# EAGLE board AniBike_v2.7_BT_MainBoard (EAGLE 5.08)
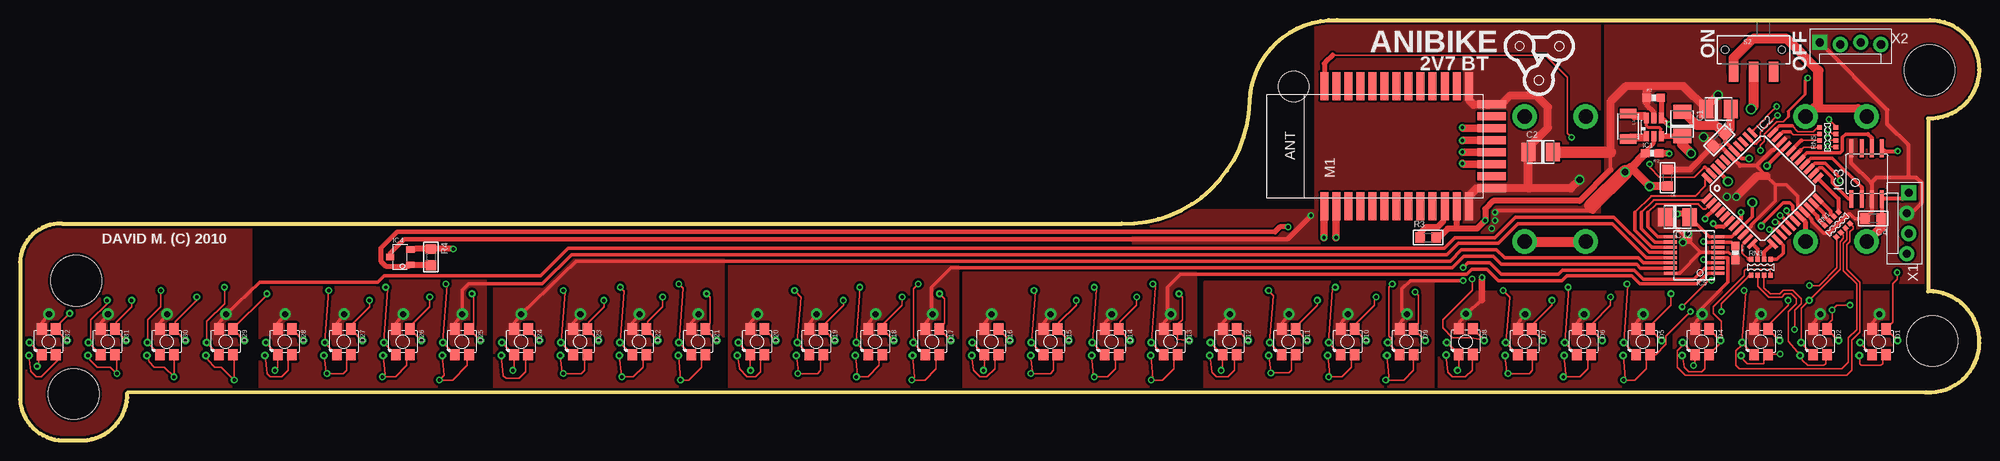
[diagram p5: board, top side]
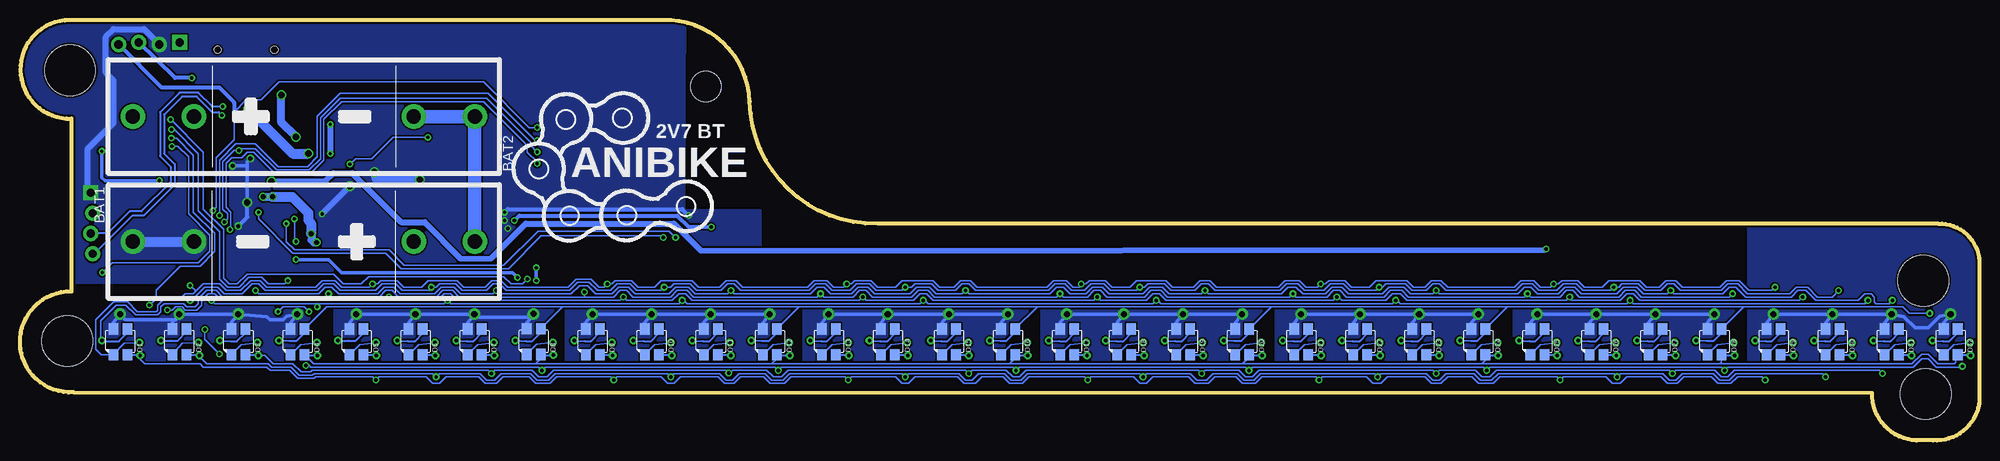
[diagram p6: board, bottom side, seen from below]

Size 244.44 x 52.44 mm. Coordinates in mm from the lower left corner, seen from the top.
Outline: 137.47,27.03 arc90 153.42,42.27 arc-90 164.29,52.43 238.25,52.43 arc-182 238.05,40.14 238.05,18.6 arc-184 237.74,6 13.39,5.94 arc-90 7.82,0.01 5.79,0.01 arc-90 0,5.09 0,22.26 arc-90 5.18,27.03 137.47,27.03
Copper layers (1*16): Top 0.035mm / dielectric 1.5mm / Bottom 0.035mm
Design rules "default *": minimum track width 8mil, minimum drill 15mil, track to track 8mil, track to pad 8mil, pad to pad 8mil, via to via 8mil, smd to smd 8mil, copper to edge 10mil, drill to drill 15mil, minimum pad ring 10mil, minimum via ring 8mil, stop-mask expansion 4mil, vias tented up to drill 32mil, thermal gap 10mil
Holes 6.35 mm at 238.56,12.4 238.2,46.19 7.01,19.92 6.71,5.8
Holes 3.81 mm at 158.88,44.13

## Footprints (pad centres in the part's own frame; a part is rotated, then mirrored left to right if it is on the bottom)
BATTERY_AAA = drill 1.778 pad 3.048 round: MINUS1 21.336,0; MINUS2 13.716,0; PLUS1 -21.336,0; PLUS2 -13.716,0
C3528-21/T = smd 1.778 x 2.286: + 1.524,0; - -1.524,0
C0805 = smd 1.2 x 1.3: 1 -1.016,0; 2 1.016,0
LED1210_DS = drill 0.432 pad 0.889 round: 1 -2.421,-0.099; 2 -2.504,-1.68; 3 2.27,0.15 | smd 1.2 x 1.4 bottom: 1_BOTTOM 0.85,-1.6; 2_BOTTOM -0.9,-1.6; 3_BOTTOM -0.9,1.6; 4_BOTTOM 0.85,1.6 | smd 1.2 x 1.4: 1_TOP -0.9,-1.6; 2_TOP 0.85,-1.6; 3_TOP 0.85,1.6; 4_TOP -0.9,1.6 | drill 0.762 pad 1.422 round: 4 0,3.454
DDC = smd 0.635 x 1.27: 1 -0.95,-1.15; 2 0,-1.15; 3 0.95,-1.15; 4 0.95,1.15; 5 0,1.15; 6 -0.95,1.15
TQFP44 = smd 1.5 x 0.5: 1 -5.8,4; 2 -5.8,3.2; 3 -5.8,2.4; 4 -5.8,1.6; 5 -5.8,0.8; 6 -5.8,0; 7 -5.8,-0.8; 8 -5.8,-1.6; 9 -5.8,-2.4; 10 -5.8,-3.2; 11 -5.8,-4; 23 5.8,-4; 24 5.8,-3.2; 25 5.8,-2.4; 26 5.8,-1.6; 27 5.8,-0.8; 28 5.8,0; 29 5.8,0.8; 30 5.8,1.6; 31 5.8,2.4; 32 5.8,3.2; 33 5.8,4 | smd 0.5 x 1.5: 12 -4,-5.8; 13 -3.2,-5.8; 14 -2.4,-5.8; 15 -1.6,-5.8; 16 -0.8,-5.8; 17 0,-5.8; 18 0.8,-5.8; 19 1.6,-5.8; 20 2.4,-5.8; 21 3.2,-5.8; 22 4,-5.8; 34 4,5.8; 35 3.2,5.8; 36 2.4,5.8; 37 1.6,5.8; 38 0.8,5.8; 39 0,5.8; 40 -0.8,5.8; 41 -1.6,5.8; 42 -2.4,5.8; 43 -3.2,5.8; 44 -4,5.8
SOIC8 = smd 0.5 x 2.2: 1 -1.905,-3.154; 2 -0.645,-3.154; 3 0.625,-3.154; 4 1.895,-3.154; 5 1.905,3.154; 6 0.635,3.154; 7 -0.635,3.154; 8 -1.905,3.154
HALL_SENSOR_SE = smd 1 x 0.8: 1 1.15,-1; 2 1.15,0.9; 3 -1.35,-0.05
TSSOP16 = smd 0.4 x 1.6: 1 -2.225,-2.85; 2 -1.575,-2.85; 3 -0.925,-2.85; 4 -0.275,-2.85; 5 0.375,-2.85; 6 1.025,-2.85; 7 1.675,-2.85; 8 2.325,-2.85; 9 2.325,3.05; 10 1.675,3.05; 11 1.025,3.05; 12 0.375,3.05; 13 -0.275,3.05; 14 -0.925,3.05; 15 -1.575,3.05; 16 -2.225,3.05
1210 = smd 1.2 x 2: 1 -1.6,0; 2 1.6,0
BTM400_6B = smd 3.5 x 1: 1 -7.4,7.66; 2 -7.4,6.16; 3 -7.4,4.66; 4 -7.4,3.16; 5 -7.4,1.66; 6 -7.4,0.16; 7 -7.4,-1.34; 8 -7.4,-2.84; 9 -7.4,-4.34; 10 -7.4,-5.84; 11 -7.4,-7.34; 12 -7.4,-8.84; 13 -7.4,-10.34; 22 7.6,-10.34; 23 7.6,-8.84; 24 7.6,-7.34; 25 7.6,-5.84; 26 7.6,-4.34; 27 7.6,-2.84; 28 7.6,-1.34; 29 7.6,0.16; 30 7.6,1.66; 31 7.6,3.16; 32 7.6,4.66; 33 7.6,6.16; 34 7.6,7.66 | smd 1 x 3.5: 14 -5.15,-13.2; 15 -3.65,-13.2; 16 -2.15,-13.2; 17 -0.65,-13.2; 18 0.85,-13.2; 19 2.35,-13.2; 20 3.85,-13.2; 21 5.35,-13.2
0603-RES = smd 1.1 x 1: 1 -0.85,0; 2 0.85,0
R0805 = smd 1.2 x 1.3: 1 -1.016,0; 2 1.016,0
YCTC164 = smd 0.559 x 0.6: P$1 -1.2,-1.003; P$2 -0.4,-1.003; P$3 0.4,-1.003; P$4 1.2,-1.003; P$5 1.2,1.003; P$6 0.4,1.003; P$7 -0.4,1.003; P$8 -1.2,1.003
SWITCH-SPDT-SMD = smd 1.2 x 2.5: 1 -2.5,-2.75; 2 0,-2.75; 3 2.5,-2.75 | hole 0.9: -3.55,0; 3.55,0
MOLEX-1X4_LOCK = drill 1.016 pad 1.88 square: 1 0,0.127 | drill 1.016 pad 1.88 round: 2 2.54,-0.127; 3 5.08,0.127; 4 7.62,-0.127

## Placement (x,y rotation side)
BAT1  BATTERY_AAA  [BATTERY_AAA]  209.04,24.8 180 bottom
BAT2  BATTERY_AAA  [BATTERY_AAA]  209.04,40.4 0 bottom
C1  10uF  [C3528-21/T]  207.37,39.48 270 top
C2  10uF  [C3528-21/T]  189.69,35.98 0 top
C3  100nF  [C0805]  211.99,37.45 225 top
C4  100nF  [C0805]  231.17,27.67 180 top
C6  100nF  [C0805]  205.54,32.78 90 top
C11  47uF  [C3528-21/T]  211.89,41.36 180 top
C12  10uF  [C3528-21/T]  206.76,27.85 180 top
D1  LED_RGB_DS  [LED1210_DS]  231.95,12.3 0 top
D2  LED_RGB_DS  [LED1210_DS]  224.59,12.3 0 top
D3  LED_RGB_DS  [LED1210_DS]  217.22,12.3 0 top
D4  LED_RGB_DS  [LED1210_DS]  209.85,12.3 0 top
D5  LED_RGB_DS  [LED1210_DS]  202.49,12.3 0 top
D6  LED_RGB_DS  [LED1210_DS]  195.12,12.3 0 top
D7  LED_RGB_DS  [LED1210_DS]  187.76,12.3 0 top
D8  LED_RGB_DS  [LED1210_DS]  180.39,12.33 0 top
D9  LED_RGB_DS  [LED1210_DS]  173.02,12.3 0 top
D10  LED_RGB_DS  [LED1210_DS]  165.66,12.3 0 top
D11  LED_RGB_DS  [LED1210_DS]  158.29,12.3 0 top
D12  LED_RGB_DS  [LED1210_DS]  150.93,12.3 0 top
D13  LED_RGB_DS  [LED1210_DS]  143.56,12.3 0 top
D14  LED_RGB_DS  [LED1210_DS]  136.19,12.3 0 top
D15  LED_RGB_DS  [LED1210_DS]  128.57,12.3 0 top
D16  LED_RGB_DS  [LED1210_DS]  121.21,12.3 0 top
D17  LED_RGB_DS  [LED1210_DS]  113.84,12.3 0 top
D18  LED_RGB_DS  [LED1210_DS]  106.73,12.3 0 top
D19  LED_RGB_DS  [LED1210_DS]  99.36,12.3 0 top
D20  LED_RGB_DS  [LED1210_DS]  92,12.3 0 top
D21  LED_RGB_DS  [LED1210_DS]  84.63,12.3 0 top
D22  LED_RGB_DS  [LED1210_DS]  77.27,12.3 0 top
D23  LED_RGB_DS  [LED1210_DS]  69.9,12.3 0 top
D24  LED_RGB_DS  [LED1210_DS]  62.53,12.3 0 top
D25  LED_RGB_DS  [LED1210_DS]  55.17,12.3 0 top
D26  LED_RGB_DS  [LED1210_DS]  47.8,12.3 0 top
D27  LED_RGB_DS  [LED1210_DS]  40.44,12.3 0 top
D28  LED_RGB_DS  [LED1210_DS]  33.07,12.3 0 top
D29  LED_RGB_DS  [LED1210_DS]  25.7,12.3 0 top
D30  LED_RGB_DS  [LED1210_DS]  18.34,12.3 0 top
D31  LED_RGB_DS  [LED1210_DS]  10.97,12.3 0 top
D32  LED_RGB_DS  [LED1210_DS]  3.61,12.3 0 top
IC1  TI_TPS61073DDC  [DDC]  203.81,39.07 0 top
IC2  ATXMEGA_XX_D4TQFP44  [TQFP44]  217.37,31.45 45 top
IC3  AT26DF321  [SOIC8]  230.38,33.28 0 top
IC4  HALL_SENSORSMT  [HALL_SENSOR_SE]  47.55,22.92 0 top
IC5  SN74CB3Q3251TSSOP16  [TSSOP16]  208.94,23.07 90 top
L1  4.7 uH  [1210]  200.61,39.18 270 top
M1  BTM400_6BBTM400_6B  [BTM400_6B]  170.38,36.59 90 top
R1  [0603-RES]  203.81,42.73 0 top
R2  [0603-RES]  203.61,35.82 180 top
R3  10K  [R0805]  175.67,25.31 0 top
R4  10K  [R0805]  51.26,22.87 270 top
R5  47k  [0603-RES]  213.97,23.4 270 top
RN1  RESISTOR_ARR4  [YCTC164]  226.72,26.93 45 top
RN3  RESISTOR_ARR4  [YCTC164]  217.17,21.6 0 top
RN5  RESISTOR_ARR4  [YCTC164]  225.5,37.83 90 top
S2  [SWITCH-SPDT-SMD]  216.26,48.73 0 top
U$1  ANIBIKE_LOGOLOGO_3_MED  [ANIBIKE_LOGO_3_MEDIUM]  189.48,47.76 0 top
U$2  ANIBIKE_LOGOLOGO_6_BIG  [ANIBIKE_LOGO_6_BIG]  168.15,34.76 0 bottom
X1  PDI_INTERFACEHEADER0.1IN  [MOLEX-1X4_LOCK]  235.51,30.9 270 top
X2  ANIBIKE_SEC_INTERFACEHEADER0.1IN  [MOLEX-1X4_LOCK]  224.54,49.51 0 top

## Tracks (layer width: path | path; a pad name or v marks a point on that pad's centre or on a via)
+3.6V  (via drill 0.41, 0.6, 0.6 pad 1.02, 0.8)
  Top 0.203: IC3.3 230.94,30.06 | IC3.8 228.5,36.41 | IC2.31 219.78,37.21 | IC2.19 222.58,28.48 | 202.96,42.64 R1.1 | 210.36,41.61 C11.+ | 51.22,21.92 R4.2 | 179.22,28.68 M1.12 | 218.75,36.22 218.7,36.22 218.6,36.24
  Top 0.305: 213.54,23.25 213.31,23.3 213.16,23.45 IC5.5
  Top 0.406: 218.95,31.91 220.37,31.91 221.79,30.49 221.79,29.27 222.58,28.48 | 209.63,23.45 208.08,25 C12.+ | 209.63,23.45 IC5.5 | 209.63,23.45 207.03,20.85 IC5.16 | 198.43,35.98 198.43,33.74 | IC2.9 216,26.69 216,26.93 218.95,29.88 218.95,31.91 | IC2.19 223.52,27.57 223.52,27.34 225.04,25.82 225.65,25.82 228.09,28.25 228.3,28.25 228.88,27.67 C4.2 | 218.95,31.91 217.88,32.98 216.61,34.25 | R5.2 213.97,22.87 213.54,23.25
  Top 0.508: C4.2 231,28.52 IC3.3 231,32.05 230.94,32.11 | 230.94,32.11 228.47,34.58 IC3.8 | 218.75,36.22 IC2.31 | 218.6,36.24 216.61,34.25 214.58,34.25 IC2.39 212.1,36.73 C3.2 | X1.2 235.92,28.36 237.24,29.68 237.24,32.11 236.53,32.83 235.61,32.83 | 235.61,32.83 231.65,32.83 230.94,32.11 | X2.1 232.97,41.21 232.97,39.43 235.61,36.79 235.61,32.83
  Top 0.559: 156.57,26.02 47.04,26.02 45.01,23.99
  Top 0.61: 45.01,23.99 45.01,22.36 45.62,21.75 48.53,21.75 IC4.1 | v158.19,26.63 157.18,26.63 156.57,26.02
  Top 0.635: R1.1 202.9,41.97 202.9,41.88 203.81,40.97 IC1.5
  Top 0.762: C3.2 208.33,33.79 C6.2 | IC4.1 51.22,21.92 | 198.43,33.74 194.56,29.88 183.79,29.88 182.78,28.86 v182.78,27.44 181.76,26.43 179.22,26.43 | R3.2 176.99,25.31 178.11,26.43 179.22,26.43 | 179.22,26.43 179.22,28.68
  Top 0.889: C3.2 210.01,37.99 v210.01,37.86
  Top 1.016: C11.+ 207.52,44.21 202.9,44.21 | 202.9,44.21 202.9,42.17 202.96,42.64 | v211.84,43.09 210.36,41.61 | 198.43,35.98 198.43,42.27 200.36,44.21 202.9,44.21 | 217.88,32.98 216.69,32.98 v214.1,30.39 | v208.13,25.76 208.13,25.05 208.08,25
  Top 1.422: 198.43,35.98 C2.+
  Bottom 0.508: v182.78,27.44 182.17,28.05 162.46,28.05 161.04,26.63 v158.19,26.63
  Bottom 1.016: v210.01,37.86 211.84,39.68 v211.84,43.09 | v214.1,30.39 v212.93,30.39 | 208.13,25.79 v208.13,25.76 | v207.45,24.7 207.76,24.7 208.06,25 208.06,25.73 208.13,25.79 | 208.13,25.79 208.14,25.78
  Bottom 1.27: v212.93,30.39 210.49,30.39 208.48,28.38 208.48,27.47 208.13,27.09 208.13,25.79
  pour Top (isolate 0.254, no thermals): 246.18,53.86 197.82,53.86 197.82,19.72 246.18,19.72
BT_KEY(NEW)  (via drill 0.41)
  Top 0.203: 210.11,34.05 208.89,32.83 204.52,32.83 203.3,34.05 v203.3,34.45 | v193.55,37.8 193.04,38.31 193.04,45.32 190.3,48.07 163.78,48.07
  Top 0.406: IC2.43 210.26,34.05 210.11,34.05
  Top 0.61: 163.78,48.07 162.87,47.15 162.72,47.01 M1.34
  Bottom 0.203: v203.3,34.45 202.59,35.16 200.56,35.16 197.92,37.8 v193.55,37.8
CS
  Top 0.406: IC2.24 224.44,33.99 224.84,33.99 226.06,32.78 226.06,32.17 228.1,30.13 IC3.1
GND  (via drill 0.41, 0.51, 0.8)
  Top 0.203: 203.81,37.82 IC1.2 | R2.2 202.86,36.04 | IC5.8 211.8,25.41 | 207.52,41 C1.- | 183.11,41.87 M1.21 183.65,42.07 | 188.27,31.44 188.16,31.54 | M1.14 183.55,31.4
  Top 0.406: v217.22,26.73 217.22,26.93 219.96,29.68 220.78,29.68 221.18,29.27 221.18,28.78 IC2.18 | v217.93,34.25 217.93,34.28 | v216.1,29.68 216.1,27.92 IC2.8 213.58,25.4 213.37,25.4 213.11,25.41 212.6,25.41 IC5.8 210.73,25.4 C12.-
  Top 0.508: 202.9,36.1 202.9,36.18 203.81,37.09 203.81,37.82 | 46.23,22.87 IC4.3 | 196.19,28.66 184.2,28.66 v184,28.46 | C4.1 232.27,27.76 IC3.4 234.87,30.13 X1.1 | 217.93,34.28 IC2.30 | C3.1 212.71,37.25 IC2.38 214.8,35.16 v215.7,35.16 | 205.28,31.76 C6.1
  Top 0.559: 46.23,23.41 47.93,25.1 158.09,25.1
  Top 0.61: IC2.18 222.76,27.2 BAT1.MINUS2 | 46.23,23.41 46.23,22.87 | v161.04,28.05 158.09,25.1
  Top 0.635: 202.86,36.04 202.9,36.1
  Top 0.762: C12.- 207.87,28.25 v206.76,28.25
  Top 0.813: 196.04,29.24 196.19,29.27 196.19,28.66
  Top 1.016: R2.2 200.93,33.98 200.93,34.08 v203.3,31.71 203.45,31.76 205.28,31.76 | C11.- 213.41,38.87 C3.1 | M1.22 180.72,42.5 181.36,41.87 183.11,41.87 | M1.14 188.27,31.44 193.48,31.44 v194.56,32.52 | M1.13 180.72,30.47 181.66,31.4 183.55,31.4 | C2.- 188.16,36.59 190.6,39.02 190.6,41.56 189.18,42.99 185.83,42.99 184.78,41.94 M1.21
  Top 1.143: 207.52,41 209.25,39.28 211.6,39.28 C3.1 | 188.16,31.54 C2.-
  Top 1.168: BAT1.MINUS1 232.18,26.6 C4.1
  Top 1.27: 200.93,33.98 200.29,33.57 v200.25,33.46
  Top 1.778: v200.25,33.46 196.04,29.24
  Bottom 0.406: v216.1,29.68 216.1,34.25 | 216.1,34.25 v217.93,34.25 | 216.1,34.25 216.1,34.76 v215.7,35.16
  Bottom 0.508: v217.22,26.73 216.1,27.85 v216.1,29.68 | v184,28.46 183.59,28.86 161.85,28.86 v161.04,28.05
  Bottom 0.762: v206.76,28.25 v203.3,31.71 | X2.2 228.98,51.29 232.77,51.29 233.73,50.33 233.73,45.88 232.77,44.92 232.77,39.63 236.02,36.38 236.02,31.51 236.07,31.35 X1.1
  Bottom 1.016: v194.56,32.52 200.05,32.52 v200.25,33.46
  Bottom 1.27: BAT1.MINUS1 BAT1.MINUS2
  other vias: 184,27.44 183.59,26.43
  pour Bottom (no thermals): 245.87,54.16 161.54,54.16 161.65,30.29 161.65,28.66 152.1,28.66 152.1,19.72 245.87,19.72
  pour Top (isolate 0.254, no thermals): 197,53.86 161.65,53.86 161.65,28.66 138.89,28.66 138.89,22.97 151.49,22.97 151.49,20.53 197,20.53
HALL_INTERRUPT  (via drill 0.41, 0.8)
  Top 0.203: IC2.42 211.58,33.8 | 49.27,23.89 IC4.2
  Top 0.508: IC2.42 213.06,32.38 v213.06,32.32
  Top 0.762: v54.05,23.89 R4.1 49.27,23.89
  Bottom 0.203: 54.25,23.78 v54.05,23.89
  Bottom 0.66: 189.48,22.67 185.73,22.67
  Bottom 0.762: v213.06,32.32 206.55,32.32 206.35,32.32 205.33,33.33 203,33.33 196.9,27.24 193.95,27.24 189.48,22.67 | 185.73,22.67 181.36,27.03 162.87,27.03 159.51,23.68 54.25,23.78
L1_B1
  Top 0.203: RN5.P$8 224.43,36.59 222.5,36.59 222.14,36.22
  Top 0.508: 222.14,36.22 IC2.28
L1_B1_LED  (via drill 0.41, 0.43)
  Top 0.203: 203.49,13.75 203.49,14.42 205.94,16.87 v205.94,18.3 | D29.3_TOP 30.79,18.13 v30.79,18.3 | v56.39,18.3 56.59,18.09 56.59,14.44 56.06,13.9 D25.3_TOP 56.17,13.75 D25.3 | v85.65,18.3 86.06,17.89 86.06,14.64 85.48,14.07 D21.3_TOP 85.63,13.75 D21.3 | v114.71,18.3 115.32,17.69 115.32,14.64 114.69,14.02 D17.3_TOP 114.84,13.75 D17.3 | v144.58,18.3 144.98,17.89 144.98,15.05 144.41,14.47 D13.3_TOP 144.41,12.6 D13.3 | v174.04,18.5 174.45,18.09 174.45,14.64 173.88,14.07 D9.3_TOP | 232.84,13.9 D1.3_TOP 233.63,14.73 233.63,19.57 234.19,20.13 v234.19,20.94 | RN5.P$1 225.5,36.63 v225.5,36.69
  Top 0.254: D1.3 232.95,13.75 D1.3_TOP | D5.3 203.49,13.75 D5.3_TOP | D9.3 174.03,13.75 D9.3_TOP | D29.3_TOP 26.71,13.75 D29.3
  Bottom 0.203: v30.79,18.3 31.19,17.89 42.16,17.89 42.98,18.7 44.2,18.7 45.01,17.89 49.89,17.89 50.7,18.7 51.51,18.7 52.32,17.89 55.98,17.89 v56.39,18.3 56.79,17.89 71.22,17.89 72.03,18.7 73.46,18.7 74.27,17.89 78.94,17.89 79.76,18.7 80.57,18.7 81.38,17.89 85.24,17.89 v85.65,18.3 86.06,17.89 101.3,17.89 102.11,18.7 103.33,18.7 104.14,17.89 108.81,17.89 109.63,18.7 110.44,18.7 111.25,17.89 114.3,17.89 v114.71,18.3 115.11,17.89 130.35,17.89 131.17,18.7 132.38,18.7 133.2,17.89 138.07,17.89 138.89,18.7 139.7,18.7 140.51,17.89 144.17,17.89 v144.58,18.3 144.98,17.89 160.43,17.89 161.24,18.7 162.46,18.7 163.27,17.89 167.94,17.89 168.76,18.7 169.57,18.7 170.38,17.89 174.04,17.89 | 174.04,17.89 v174.04,18.5 | 174.04,17.89 189.69,17.89 190.5,18.7 191.72,18.7 192.53,17.89 197.21,17.89 198.02,18.7 198.83,18.7 199.64,17.89 205.54,17.89 v205.94,18.3 206.35,17.89 219.15,17.89 219.96,18.7 221.18,18.7 222.2,17.69 222.2,17.08 222.61,16.67 223.62,16.67 224.03,17.08 226.47,17.08 226.87,16.67 226.87,16.06 227.28,15.66 230.02,15.66 231.24,16.87 232.46,16.87 234.39,14.94 234.39,12.71 234.24,12.45 D1.3 | v225.5,36.69 224.79,36.69 223.42,35.37 223.42,28.25 220.78,25.61 220.78,23.58 222.2,22.16 232.97,22.16 v234.19,20.94
  Bottom 0.254: D1.3_BOTTOM 231.05,13.43 232.13,12.35 234.07,12.35 D1.3 | D5.3_BOTTOM 201.59,13.43 202.56,12.46 203.49,12.46 D5.3 | D9.3_BOTTOM 172.12,13.51 173.23,12.4 173.98,12.4 D9.3 | D13.3_BOTTOM 142.66,13.51 143.76,12.4 144.51,12.4 D13.3 | D17.3_BOTTOM 112.94,13.36 113.89,12.4 114.79,12.4 D17.3 | D21.3_BOTTOM 83.73,13.3 84.63,12.4 85.58,12.4 D21.3 | D25.3_BOTTOM 54.27,13.51 55.37,12.4 56.12,12.4 D25.3 | D29.3_BOTTOM 24.81,13.51 25.91,12.4 26.66,12.4 D29.3
L1_B2
  Top 0.203: RN5.P$7 222.22,37.43
  Top 0.508: 222.22,37.43 IC2.29
L1_B2_LED  (via drill 0.41, 0.43)
  Top 0.203: 19.34,13.75 19.34,14.78 22.05,17.48 v22.05,17.89 | 48.8,13.75 48.8,14.37 51.11,16.67 v51.11,17.89 | 78.27,13.75 78.27,14.78 80.16,16.67 v80.16,17.89 | 107.73,13.75 107.73,14.57 110.03,16.87 v110.03,17.89 | 137.19,13.75 137.19,14.78 139.29,16.87 v139.29,17.89 | 166.66,13.75 166.66,14.57 168.96,16.87 168.96,17.69 v169.16,17.89 | 196.12,13.75 196.12,14.57 198.43,16.87 v198.43,17.89 | 225.59,14.57 226.06,15.05 v226.06,16.27 226.67,16.87 v228.3,16.87 | RN5.P$2 225.84,37.43 v225.55,37.7
  Top 0.254: 225.59,13.75 D2.3 | 225.59,13.75 D2.3_TOP | D6.3 196.12,13.75 D6.3_TOP | D10.3 166.66,13.75 D10.3_TOP | D14.3 137.19,13.75 D14.3_TOP | D18.3 107.73,13.75 D18.3_TOP | D22.3 78.27,13.75 D22.3_TOP | D26.3 48.8,13.75 D26.3_TOP | D30.3 19.34,13.75 D30.3_TOP | 225.59,14.57 225.59,13.75
  Bottom 0.203: v22.05,17.89 22.45,17.48 42.37,17.48 43.18,18.3 43.99,18.3 44.81,17.48 50.9,17.48 51.11,17.69 v51.11,17.89 51.51,17.48 71.43,17.48 72.24,18.3 73.25,18.3 74.07,17.48 79.55,17.48 79.96,17.89 v80.16,17.89 80.57,17.48 101.5,17.48 102.31,18.3 103.12,18.3 103.94,17.48 109.63,17.48 v110.03,17.89 110.44,17.48 130.56,17.48 131.37,18.3 132.18,18.3 132.99,17.48 138.89,17.48 v139.29,17.89 139.7,17.48 160.63,17.48 161.44,18.3 162.25,18.3 163.07,17.48 168.76,17.48 v169.16,17.89 169.57,17.48 189.89,17.48 190.7,18.3 191.52,18.3 192.33,17.48 198.02,17.48 v198.43,17.89 198.83,17.48 219.35,17.48 220.17,18.3 220.98,18.3 221.79,17.48 221.79,16.87 222.4,16.27 223.83,16.27 224.23,16.67 225.04,16.67 225.45,16.27 v226.06,16.27 | v225.55,37.7 224.89,37.7 222.81,35.57 222.81,28.46 220.17,25.82 220.17,23.58 222,21.75 224.43,21.75 227.48,18.7 227.48,17.69 v228.3,16.87
  Bottom 0.254: D2.3_BOTTOM 223.69,13.53 224.77,12.46 225.58,12.46 D2.3 | D6.3_BOTTOM 194.22,13.36 195.17,12.4 196.07,12.4 D6.3 | D10.3_BOTTOM 164.76,13.36 165.71,12.4 166.61,12.4 D10.3 | D14.3_BOTTOM 135.3,13.36 136.25,12.4 137.15,12.4 D14.3 | D18.3_BOTTOM 105.83,13.36 106.78,12.4 107.68,12.4 D18.3 | D22.3_BOTTOM 76.37,13.36 77.32,12.4 78.22,12.4 D22.3 | D26.3_BOTTOM 46.9,13.36 47.85,12.4 48.75,12.4 D26.3 | D30.3_BOTTOM 17.44,13.56 18.59,12.4 19.29,12.4 D30.3
L1_B3
  Top 0.203: 220.83,38.52 221.22,38.13 221.39,38.11 224.38,38.11 RN5.P$6
  Top 0.406: IC2.32 219.91,38.52 220.83,38.52
L1_B3_LED  (via drill 0.41, 0.43)
  Top 0.203: 11.97,13.75 11.97,14.73 13.92,16.67 v13.92,17.48 | 41.44,13.75 41.44,14.52 43.59,16.67 v43.59,17.48 | 70.9,13.75 70.9,14.73 72.85,16.67 v72.85,17.48 | 100.37,13.75 100.37,14.52 102.72,16.87 v102.72,17.48 | 129.58,13.75 129.58,14.67 131.78,16.87 v131.78,17.48 | 159.29,13.75 159.29,14.32 161.85,16.87 v161.85,17.48 | 188.76,13.75 188.76,14.52 191.11,16.87 v191.11,17.48 | 218.22,13.75 218.22,14.52 220.57,16.87 v220.57,17.48 | RN5.P$3 226.09,38.23 v225.55,38.77 | v211.02,19.92 210.62,19.92 v207.37,16.67
  Top 0.254: D3.3 218.22,13.75 D3.3_TOP | D7.3 188.76,13.75 D7.3_TOP | D11.3 159.29,13.75 D11.3_TOP | D15.3 129.58,13.75 D15.3_TOP | D19.3 100.37,13.75 D19.3_TOP | D23.3 70.9,13.75 D23.3_TOP | D27.3 41.44,13.75 D27.3_TOP | D31.3 11.97,13.75 D31.3_TOP
  Bottom 0.203: v13.92,17.48 14.33,17.08 43.18,17.08 v43.59,17.48 43.99,17.08 72.24,17.08 72.64,17.48 v72.85,17.48 73.25,17.08 102.11,17.08 102.51,17.48 v102.72,17.48 103.12,17.08 131.17,17.08 131.57,17.48 v131.78,17.48 132.18,17.08 161.24,17.08 161.65,17.48 v161.85,17.48 162.25,17.08 190.7,17.08 v191.11,17.48 191.52,17.08 207.37,17.08 | 207.37,17.08 220.17,17.08 v220.57,17.48 | v225.55,38.77 225.15,38.77 222.2,35.77 222.2,28.66 219.56,26.02 219.56,20.13 218.54,19.11 217.12,19.11 215.9,20.33 214.27,20.33 213.46,19.52 211.43,19.52 v211.02,19.92 | v207.37,16.67 207.37,17.08
  Bottom 0.254: D3.3_BOTTOM 216.32,13.43 217.4,12.35 218.12,12.35 D3.3 | D7.3_BOTTOM 186.86,13.41 187.86,12.4 188.71,12.4 D7.3 | D11.3_BOTTOM 157.39,13.41 158.39,12.4 159.24,12.4 D11.3 | D15.3_BOTTOM 127.68,13.46 128.73,12.4 129.53,12.4 D15.3 | D19.3_BOTTOM 98.47,13.41 99.47,12.4 100.32,12.4 D19.3 | D23.3_BOTTOM 69,13.41 70,12.4 70.85,12.4 D23.3 | D27.3_BOTTOM 39.54,13.41 40.54,12.4 41.39,12.4 D27.3 | D31.3_BOTTOM 10.07,13.41 11.07,12.4 11.92,12.4 D31.3
L1_B4
  Top 0.203: 221.08,39.23 221.79,38.52 223.72,38.52 224.24,39.03 RN5.P$5
  Top 0.406: 221.08,39.23 219.49,39.23 IC2.33
L1_B4_LED  (via drill 0.41, 0.43)
  Top 0.203: 4.61,13.75 4.61,14.27 v6.2,15.86 | RN5.P$4 226.5,39.19 v225.65,40.04 | v181.15,20.13 181.15,18.7 177.5,15.05 177.5,14.03 178.71,12.81 181.06,12.81 D8.3
  Top 0.254: D4.3 210.86,13.75 D4.3_TOP | D8.3 181.39,13.78 D8.3_TOP | D12.3 151.93,13.75 D12.3_TOP | D16.3 122.21,13.75 D16.3_TOP | D20.3 93,13.75 D20.3_TOP | D24.3 63.54,13.75 D24.3_TOP | D32.3 4.61,13.75 D32.3_TOP | D28.3_TOP 34.07,13.75 D28.3
  Bottom 0.203: 29.4,16.67 9.55,16.67 8.74,15.86 v6.2,15.86 | 29.4,16.67 D28.3_BOTTOM | 58.87,16.67 29.4,16.67 | 58.87,16.67 D24.3_BOTTOM | 88.33,16.67 58.87,16.67 | 88.33,16.67 D20.3_BOTTOM | 117.54,16.67 88.33,16.67 | 117.54,16.67 D16.3_BOTTOM | 147.26,16.67 117.54,16.67 | 147.26,16.67 D12.3_BOTTOM | 176.75,16.67 147.26,16.67 | D8.3_BOTTOM 176.75,16.67 | 176.75,16.67 206.19,16.67 D4.3_BOTTOM | v225.65,40.04 221.59,35.98 221.59,28.86 219.05,26.32 219.05,20.23 218.34,19.52 217.32,19.52 216.1,20.74 205.33,20.74 204.11,19.52 201.88,19.52 200.97,20.43 184.1,20.43 183.19,19.52 181.76,19.52 v181.15,20.13
  Bottom 0.254: D4.3_BOTTOM 208.96,13.43 209.98,12.4 210.81,12.4 D4.3 | D8.3_BOTTOM 179.49,13.46 180.54,12.4 181.32,12.4 D8.3 | D12.3_BOTTOM 150.03,13.46 151.08,12.4 151.88,12.4 D12.3 | D16.3_BOTTOM 120.31,13.51 121.41,12.4 122.16,12.4 D16.3 | D20.3_BOTTOM 91.1,13.46 92.15,12.4 92.95,12.4 D20.3 | D24.3_BOTTOM 61.64,13.46 62.69,12.4 63.49,12.4 D24.3 | D28.3_BOTTOM 32.17,13.46 33.22,12.4 34.02,12.4 D28.3 | D32.3_BOTTOM 2.71,13.46 3.76,12.4 4.56,12.4 D32.3
L1_G1
  Top 0.254: IC2.10 214.88,24.44 214.88,23.38 215.66,22.6
  Top 0.508: RN3.P$8 215.66,22.6
L1_G1_LED  (via drill 0.41, 0.43)
  Top 0.203: 26.62,10.88 26.72,10.78 v26.72,7.53 25.09,9.15 24.28,9.15 23.46,9.98 D29.2 | 26.62,10.88 26.56,10.94 | D25.2 52.92,8.12 v52.32,7.53 53.95,7.53 55.78,9.36 55.78,10.46 D25.2_TOP | D21.2 82.38,7.54 v82.4,7.53 83.41,7.53 85.04,9.15 85.04,10.26 D21.2_TOP | D17.2 111.59,7.87 v111.25,7.53 112.88,7.53 114.3,8.95 114.3,10.31 D17.2_TOP | D13.2 141.31,7.72 v141.12,7.53 142.55,7.53 143.97,8.95 143.97,10.26 D13.2_TOP | D9.2 170.78,7.92 v170.38,7.53 172.62,7.53 173.84,8.75 173.84,10.67 D9.2_TOP | D5.2 200.24,7.72 v200.05,7.53 201.47,7.53 202.9,8.95 202.9,10.26 D5.2_TOP 204.04,10.7 205.33,12 205.33,13.01 v208.38,16.06 | D1.2_TOP 232.36,10.26 232.36,9.56 232.16,9.36 229.72,9.36 229.5,9.57 D1.2 | D29.2_TOP 26.56,10.82 26.62,10.88 | RN3.P$1 215.76,20.6 215.29,20.13 212.24,17.07 v212.24,16.06
  Bottom 0.203: v26.72,7.53 27.13,7.93 30.18,7.93 30.99,7.12 32.61,7.12 33.43,7.93 36.88,7.93 37.69,7.12 38.91,7.12 39.73,7.93 43.99,7.93 44.81,7.12 45.82,7.12 46.63,7.93 51.92,7.93 v52.32,7.53 52.73,7.93 59.84,7.93 60.66,7.12 62.48,7.12 63.3,7.93 66.34,7.93 67.16,7.12 68.38,7.12 69.19,7.93 73.86,7.93 74.68,7.12 75.69,7.12 76.51,7.93 81.99,7.93 v82.4,7.53 82.8,7.93 89.51,7.93 90.32,7.12 91.95,7.12 92.76,7.93 95.4,7.93 96.22,7.12 97.84,7.12 98.65,7.93 103.12,7.93 103.94,7.12 104.75,7.12 105.56,7.93 110.85,7.93 v111.25,7.53 111.66,7.93 118.57,7.93 119.38,7.12 121.01,7.12 121.82,7.93 124.46,7.93 125.27,7.12 126.7,7.12 127.51,7.93 132.79,7.93 133.6,7.12 134.42,7.12 135.23,7.93 140.72,7.93 v141.12,7.53 141.53,7.93 148.23,7.93 149.05,7.12 150.88,7.12 151.69,7.93 154.53,7.93 155.35,7.12 156.57,7.12 157.38,7.93 162.05,7.93 162.87,7.12 163.68,7.12 164.49,7.93 169.98,7.93 v170.38,7.53 170.79,7.93 177.5,7.93 178.31,7.12 180.14,7.12 180.95,7.93 184.2,7.93 185.01,7.12 186.44,7.12 187.25,7.93 191.31,7.93 192.13,7.12 192.94,7.12 193.75,7.93 199.64,7.93 v200.05,7.53 200.46,7.93 207.57,7.93 207.77,7.73 209.8,7.73 210.82,8.75 213.26,8.75 213.67,9.15 221.59,9.15 222,9.56 228.91,9.56 229.7,10.36 D1.2 | v212.24,16.06 211.63,16.67 208.99,16.67 v208.38,16.06
  Bottom 0.254: D29.2 24.73,10.62 D29.2_BOTTOM | D25.2 54.19,10.62 D25.2_BOTTOM | D21.2 83.65,10.62 D21.2_BOTTOM | D17.2 112.86,10.62 D17.2_BOTTOM | D13.2 142.58,10.62 D13.2_BOTTOM | D9.2 172.05,10.62 D9.2_BOTTOM | D5.2 201.51,10.62 D5.2_BOTTOM | D1.2 230.97,10.62 D1.2_BOTTOM
L1_G2
  Top 0.508: IC2.11 216.77,23.86 RN3.P$7
L1_G2_LED  (via drill 0.43)
  Top 0.203: 19.19,11 19.2,10.98 19.2,10.72 | 19.2,10.72 v19.2,7.93 17.98,9.15 16.76,9.15 16.09,9.83 D30.2 | D26.2 45.55,8.27 v45.21,7.93 46.84,7.93 48.26,9.36 48.26,10.31 D26.2_TOP | D22.2 75.02,8 v75.08,7.93 76.51,7.93 77.72,9.15 77.72,10.31 D22.2_TOP | D18.2 104.48,8.07 v104.34,7.93 105.77,7.93 107.19,9.36 107.19,10.31 D18.2_TOP | D14.2 133.94,8 v134.01,7.93 135.64,7.93 136.65,8.95 136.65,10.31 D14.2_TOP | D10.2 163.41,8.07 v163.27,7.93 164.9,7.93 166.12,9.15 166.12,10.31 D10.2_TOP | D6.2 192.87,8.27 v192.53,7.93 194.56,7.93 195.58,8.95 195.58,10.31 D6.2_TOP | D2.2_TOP 225.25,10.51 225.25,9.56 225.04,9.36 223.01,9.36 222.34,10.03 D2.2 220.57,12.39 220.57,16.06 221.59,17.08 221.59,17.69 220.98,18.3 220.17,18.3 219.76,17.89 218.14,17.89 216.77,19.26 RN3.P$2 | 19.2,10.72 D30.2_TOP
  Bottom 0.203: v19.2,7.93 19.61,8.34 30.38,8.34 31.19,7.53 32.41,7.53 33.22,8.34 37.08,8.34 37.9,7.53 38.71,7.53 39.52,8.34 44.81,8.34 v45.21,7.93 45.62,8.34 60.05,8.34 60.86,7.53 62.28,7.53 63.09,8.34 66.55,8.34 67.36,7.53 68.17,7.53 68.99,8.34 74.68,8.34 v75.08,7.93 75.49,8.34 89.71,8.34 90.53,7.53 91.75,7.53 92.56,8.34 95.61,8.34 96.42,7.53 97.64,7.53 98.45,8.34 103.94,8.34 v104.34,7.93 104.75,8.34 118.77,8.34 119.58,7.53 120.8,7.53 121.62,8.34 124.87,8.34 125.68,7.53 126.49,7.53 127.31,8.34 133.6,8.34 v134.01,7.93 134.42,8.34 148.44,8.34 149.25,7.53 150.67,7.53 151.49,8.34 154.74,8.34 155.55,7.53 156.36,7.53 157.18,8.34 162.87,8.34 v163.27,7.93 163.68,8.34 177.7,8.34 178.51,7.53 179.93,7.53 180.75,8.34 184.4,8.34 185.22,7.53 186.23,7.53 187.05,8.34 192.13,8.34 v192.53,7.93 192.94,8.34 207.77,8.34 207.98,8.14 209.6,8.14 210.62,9.15 213.06,9.15 213.46,9.56 221.18,9.56 222.25,10.62 D2.2
  Bottom 0.254: D30.2 17.36,10.62 D30.2_BOTTOM | D26.2 46.82,10.62 D26.2_BOTTOM | D22.2 76.29,10.62 D22.2_BOTTOM | D18.2 105.75,10.62 D18.2_BOTTOM | D14.2 135.22,10.62 D14.2_BOTTOM | D10.2 164.68,10.62 D10.2_BOTTOM | D6.2 194.14,10.62 D6.2_BOTTOM | D2.2 223.61,10.62 D2.2_BOTTOM
L1_G3
  Top 0.508: IC2.12 217.57,23.45 RN3.P$6
L1_G3_LED  (via drill 0.41, 0.43)
  Top 0.203: 11.89,10.78 12.09,10.58 v12.09,8.34 11.28,9.15 9.65,9.15 8.72,10.08 D31.2 | 11.89,10.78 11.82,10.84 | D27.2 38.19,8.46 v38.3,8.34 40.34,8.34 40.74,8.75 40.74,10.16 D27.2_TOP | D23.2 67.65,8.46 v67.77,8.34 70,8.34 70.41,8.75 70.41,10.36 D23.2_TOP | D19.2 97.12,8.43 v97.03,8.34 99.47,8.34 99.87,8.75 99.87,10.36 D19.2_TOP | D15.2 126.33,8.58 v126.09,8.34 128.52,8.34 128.93,8.75 128.93,10.21 D15.2_TOP | D11.2 v156.04,8.43 158.28,8.43 158.6,8.75 158.6,10.16 D11.2_TOP | D7.2 185.51,8.46 v185.62,8.34 188.27,8.34 188.67,8.75 188.67,10.64 D7.2_TOP | D3.2 214.97,10.08 215.49,9.56 217.53,9.56 217.53,10.16 D3.2_TOP 218.15,10.78 v219.56,10.78 | D31.2_TOP 11.89,10.77 11.89,10.78 | RN3.P$3 217.57,19.07 218.34,18.3 219.56,18.3 219.96,18.7 221.18,18.7 222.2,17.69 222.2,17.08 221.39,16.27 v221.39,13.83
  Bottom 0.203: v12.09,8.34 12.5,8.75 30.58,8.75 31.39,7.93 32.21,7.93 33.02,8.75 37.9,8.75 v38.3,8.34 38.71,8.75 60.25,8.75 61.06,7.93 62.08,7.93 62.89,8.75 67.36,8.75 v67.77,8.34 68.17,8.75 89.92,8.75 90.73,7.93 91.54,7.93 92.35,8.75 96.62,8.75 v97.03,8.34 97.43,8.75 118.97,8.75 119.79,7.93 120.6,7.93 121.41,8.75 125.68,8.75 v126.09,8.34 126.49,8.75 148.64,8.75 149.45,7.93 150.47,7.93 151.28,8.75 155.55,8.75 155.96,8.34 v156.04,8.43 156.36,8.75 177.9,8.75 178.71,7.93 179.73,7.93 180.54,8.75 185.22,8.75 v185.62,8.34 186.03,8.75 207.98,8.75 208.18,8.54 209.4,8.54 210.41,9.56 212.85,9.56 213.92,10.62 D3.2 | v221.39,13.83 221.39,12.61 v219.56,10.78
  Bottom 0.254: D31.2 9.99,10.62 D31.2_BOTTOM | D27.2 39.46,10.62 D27.2_BOTTOM | D23.2 68.92,10.62 D23.2_BOTTOM | D19.2 98.39,10.62 D19.2_BOTTOM | D15.2 127.6,10.62 D15.2_BOTTOM | D11.2 157.31,10.62 D11.2_BOTTOM | D7.2 186.78,10.62 D7.2_BOTTOM | D3.2 216.24,10.62 D3.2_BOTTOM
L1_G4
  Top 0.406: IC2.13 219.96,24.34 219.96,23.38 219.19,22.6 RN3.P$5
L1_G4_LED
  Top 0.203: D32.2_TOP 4.78,10.38 4.78,10.07 2.64,7.93 2.03,7.93 1.36,8.61 D32.2 | D28.2_TOP 33.43,10.21 33.43,8.75 32.61,7.93 31.19,7.93 30.82,8.3 D28.2 | D24.2_TOP 63.09,10.41 63.09,8.54 62.28,7.73 60.66,7.73 60.29,8.1 D24.2 | D20.2_TOP 92.35,10.21 92.35,8.54 91.75,7.93 90.73,7.93 89.75,8.91 D20.2 | D16.2_TOP 121.62,10.26 121.62,8.95 120.6,7.93 119.79,7.93 118.96,8.76 D16.2 | D12.2_TOP 151.49,10.41 151.49,8.75 150.67,7.93 149.25,7.93 148.68,8.51 D12.2 | D8.2_TOP 181.15,10.64 181.15,8.75 180.34,7.93 178.71,7.93 178.14,8.51 D8.2 | D4.2 207.61,9.12 208.18,8.54 209.8,8.54 210.21,8.95 210.21,10.21 D4.2_TOP 212.24,12.24 212.24,14.84 211.23,15.86 211.23,16.67 215.09,20.53 215.09,21.14 215.29,21.35 218.14,21.35 218.37,21.11 RN3.P$4
  Bottom 0.203: 208.88,10.62 207.81,9.56 180.14,9.56 | 180.14,9.56 179.49,10.21 D8.2_BOTTOM | 150.67,9.56 180.14,9.56 | 150.67,9.56 150.03,10.21 D12.2_BOTTOM | 121.01,9.56 150.67,9.56 | 121.01,9.56 120.31,10.26 D16.2_BOTTOM | 91.95,9.56 121.01,9.56 | 91.95,9.56 91.1,10.41 D20.2_BOTTOM | 62.08,9.56 91.95,9.56 | 62.08,9.56 61.64,10 D24.2_BOTTOM | 32.41,9.56 62.08,9.56 | 32.41,9.56 32.21,9.76 32.21,10.67 D28.2_BOTTOM | 32.41,9.56 8.43,9.56 7.21,10.78 6.4,10.78 5.18,9.56 3.15,9.56 2.95,9.76 2.95,10.46 D32.2_BOTTOM
  Bottom 0.254: D32.2 2.63,10.62 D32.2_BOTTOM | D28.2 32.09,10.62 D28.2_BOTTOM | D24.2 61.56,10.62 D24.2_BOTTOM | D20.2 91.02,10.62 D20.2_BOTTOM | D16.2 120.23,10.62 D16.2_BOTTOM | D12.2 149.95,10.62 D12.2_BOTTOM | D8.2 179.41,10.65 D8.2_BOTTOM | D4.2 208.88,10.62 D4.2_BOTTOM
L1_R1
  Top 0.508: IC2.20 224.23,27.99 224.23,27.73 RN1.P$8
L1_R1_LED  (via drill 0.41, 0.43)
  Top 0.203: D29.1 23.27,12.48 23.27,14.84 25.5,17.08 v25.5,19.11 | v53.14,19.52 53.26,19.4 D25.1 | v82.19,19.52 82.72,18.99 D21.1 | v112.06,19.52 111.46,18.91 111.46,12.81 111.93,12.34 D17.1 | v141.33,19.52 141.65,19.19 D13.1 | v171.2,19.52 170.79,19.11 170.79,13.01 171.11,12.69 D9.1 | v200.46,19.52 200.58,19.4 D5.1 | v223.22,19.31 224.43,19.31 226.67,21.55 226.67,25.29 RN1.P$1
  Top 0.254: D29.1 23.79,11.72 D29.1_TOP | D25.1 53.26,11.72 D25.1_TOP | D21.1 82.72,11.72 D21.1_TOP | D17.1 111.93,11.72 D17.1_TOP | D13.1 141.65,11.72 D13.1_TOP | D9.1 171.11,11.72 D9.1_TOP | D5.1 200.58,11.72 D5.1_TOP | D1.1 230.04,11.72 D1.1_TOP
  Bottom 0.203: D29.1_BOTTOM 25.31,11.95 D29.1 | D25.1_BOTTOM 54.77,11.95 D25.1 | D21.1_BOTTOM 84.24,11.95 D21.1 | D17.1_BOTTOM 113.45,11.95 D17.1 | D13.1_BOTTOM 143.16,11.95 D13.1 | D9.1_BOTTOM 172.63,11.95 D9.1 | D5.1_BOTTOM 202.09,11.95 D5.1 | D1.1 231.45,12.15 D1.1_BOTTOM 234.31,10.7 235,11.39 235,15.05 232.77,17.28 231.04,17.28 229.82,16.06 227.48,16.06 227.28,16.27 227.28,16.87 226.67,17.48 224.64,17.48 223.83,18.3 222.81,18.3 222.4,18.7 | v25.5,19.11 25.91,18.7 28.75,18.7 29.97,19.92 31.6,19.92 32.41,19.11 37.08,19.11 37.9,19.92 39.12,19.92 39.93,19.11 41.55,19.11 42.37,19.92 46.23,19.92 47.04,19.11 49.28,19.11 50.09,19.92 52.12,19.92 52.53,19.52 v53.14,19.52 53.54,19.11 54.76,19.11 55.58,19.92 57.2,19.92 58.01,19.11 66.34,19.11 67.16,19.92 68.38,19.92 69.19,19.11 70.61,19.11 71.43,19.92 75.29,19.92 76.1,19.11 78.33,19.11 79.15,19.92 81.18,19.92 81.59,19.52 v82.19,19.52 82.6,19.11 84.02,19.11 84.84,19.92 86.67,19.92 87.48,19.11 95.2,19.11 96.01,19.92 97.23,19.92 98.04,19.11 100.69,19.11 101.5,19.92 105.16,19.92 105.97,19.11 108.2,19.11 109.02,19.92 111.05,19.92 111.46,19.52 111.86,19.52 | 111.86,19.52 v112.06,19.52 | 111.86,19.52 112.27,19.11 113.08,19.11 113.89,19.92 115.52,19.92 116.33,19.11 125.07,19.11 125.88,19.92 127.1,19.92 127.91,19.11 129.74,19.11 130.56,19.92 134.42,19.92 135.23,19.11 137.47,19.11 138.28,19.92 140.31,19.92 140.72,19.52 v141.33,19.52 141.73,19.11 142.95,19.11 143.76,19.92 145.39,19.92 146.2,19.11 154.33,19.11 155.14,19.92 156.36,19.92 157.18,19.11 159.82,19.11 160.63,19.92 164.49,19.92 165.3,19.11 167.34,19.11 168.15,19.92 170.18,19.92 170.59,19.52 v171.2,19.52 171.6,19.11 172.21,19.11 173.23,20.13 175.06,20.13 176.07,19.11 183.59,19.11 184.4,19.92 185.62,19.92 186.44,19.11 189.08,19.11 189.89,19.92 193.55,19.92 194.36,19.11 196.6,19.11 197.41,19.92 199.44,19.92 199.85,19.52 v200.46,19.52 200.86,19.11 204.32,19.11 205.13,19.92 206.76,19.92 207.57,19.11 213.67,19.11 214.48,19.92 215.7,19.92 216.92,18.7 218.75,18.7 219.56,19.52 221.59,19.52 222.4,18.7
  Bottom 0.203: v223.22,19.31 222.61,18.7 222.4,18.7
L1_R2
  Top 0.508: IC2.21 225.04,28.31 225.04,28.04 RN1.P$7
L1_R2_LED  (via drill 0.43)
  Top 0.203: 16.43,11.72 15.95,12.19 15.95,15.05 17.58,16.67 v17.58,18.7 | v45.62,19.11 45.89,18.84 D26.1 | v74.88,19.11 75.35,18.64 D22.1 | v104.75,19.11 104.82,19.04 D18.1 | v134.01,19.11 134.28,18.84 D14.1 | v164.08,19.11 163.75,18.84 D10.1 | v193.14,19.11 193.21,19.04 D6.1 | D2.1 222.65,11.95 222.2,12.4 222.2,16.47 v223.22,17.48 227.08,21.35 227.08,24.8 227.48,25.21 227.48,25.61 RN1.P$2
  Top 0.254: D30.1 16.43,11.72 D30.1_TOP | D26.1 45.89,11.72 D26.1_TOP | D22.1 75.35,11.72 D22.1_TOP | D18.1 104.82,11.72 D18.1_TOP | D14.1 134.28,11.72 D14.1_TOP | D10.1 163.75,11.72 D10.1_TOP | D6.1 193.21,11.72 D6.1_TOP | D2.1 222.67,11.72 D2.1_TOP
  Bottom 0.203: D30.1_BOTTOM 17.94,11.95 D30.1 | D26.1_BOTTOM 47.41,11.95 D26.1 | D22.1_BOTTOM 76.87,11.95 D22.1 | D18.1_BOTTOM 106.33,11.95 D18.1 | D14.1_BOTTOM 135.8,11.95 D14.1 | D10.1_BOTTOM 165.26,11.95 D10.1 | D6.1_BOTTOM 194.73,11.95 D6.1 | D2.1_BOTTOM 224.19,12.15 D2.1 | v17.58,18.7 18.39,17.89 20.22,17.89 21.44,19.11 22.86,19.11 23.67,18.3 28.96,18.3 30.18,19.52 31.39,19.52 32.21,18.7 37.29,18.7 38.1,19.52 38.91,19.52 39.73,18.7 41.76,18.7 42.57,19.52 44.6,19.52 45.01,19.11 v45.62,19.11 46.03,18.7 49.48,18.7 50.29,19.52 51.92,19.52 52.73,18.7 54.97,18.7 55.78,19.52 57,19.52 57.81,18.7 66.55,18.7 67.36,19.52 68.17,19.52 68.99,18.7 70.81,18.7 71.63,19.52 74.07,19.52 74.47,19.11 v74.88,19.11 75.29,18.7 78.54,18.7 79.35,19.52 80.98,19.52 81.79,18.7 84.23,18.7 85.04,19.52 86.46,19.52 87.27,18.7 95.4,18.7 96.22,19.52 97.03,19.52 97.84,18.7 100.89,18.7 101.7,19.52 103.73,19.52 104.14,19.11 v104.75,19.11 105.16,18.7 108.41,18.7 109.22,19.52 110.85,19.52 111.66,18.7 113.28,18.7 114.1,19.52 115.32,19.52 116.13,18.7 125.27,18.7 126.09,19.52 126.9,19.52 127.71,18.7 129.95,18.7 130.76,19.52 132.79,19.52 133.2,19.11 v134.01,19.11 134.42,18.7 137.67,18.7 138.48,19.52 140.11,19.52 140.92,18.7 143.15,18.7 143.97,19.52 145.19,19.52 146,18.7 154.53,18.7 155.35,19.52 156.16,19.52 156.97,18.7 160.02,18.7 160.83,19.52 162.87,19.52 163.27,19.11 v164.08,19.11 164.49,18.7 167.54,18.7 168.35,19.52 169.98,19.52 170.79,18.7 172.42,18.7 173.43,19.72 174.85,19.72 175.87,18.7 183.79,18.7 184.61,19.52 185.42,19.52 186.23,18.7 189.28,18.7 190.09,19.52 192.13,19.52 192.53,19.11 192.94,19.11
  Bottom 0.203: 192.94,19.11 v193.14,19.11 | 192.94,19.11 193.35,18.7 196.8,18.7 197.61,19.52 199.24,19.52 200.05,18.7 204.52,18.7 205.33,19.52 206.55,19.52 207.37,18.7 213.87,18.7 214.68,19.52 215.49,19.52 216.71,18.3 218.95,18.3 219.76,19.11 221.39,19.11 223.01,17.48 v223.22,17.48
L1_R3
  Top 0.508: IC2.22 225.86,28.63 225.86,28.36 RN1.P$6
L1_R3_LED  (via drill 0.43)
  Top 0.203: D31.1 8.84,12.17 8.84,15.05 10.87,17.08 v10.87,17.48 | v38.51,18.7 38.52,18.69 D27.1 | v67.77,18.7 67.99,18.48 D23.1 | v96.62,18.7 97.45,17.87 D19.1 | v126.49,18.7 126.66,18.53 D15.1 | v155.75,18.7 156.38,18.08 D11.1 | v185.01,18.7 185.84,17.87 D7.1 | v215.09,18.7 215.31,18.48 D3.1 214.84,11.95 214.07,11.19 214.07,9.36 214.48,8.95 227.28,8.95 228.09,9.76 228.09,12.81 229.11,13.83 229.11,19.52 227.48,21.14 227.48,24.6 227.89,25 227.89,26.33 RN1.P$3
  Top 0.254: D31.1 9.06,11.72 D31.1_TOP | D27.1 38.52,11.72 D27.1_TOP | D23.1 67.99,11.72 D23.1_TOP | D19.1 97.45,11.72 D19.1_TOP | D15.1 126.66,11.72 D15.1_TOP | D11.1 156.38,11.72 D11.1_TOP | D7.1 185.84,11.72 D7.1_TOP | D3.1 215.31,11.72 D3.1_TOP
  Bottom 0.203: D31.1_BOTTOM 10.58,11.95 D31.1 | D27.1_BOTTOM 40.04,11.95 D27.1 | D23.1_BOTTOM 69.5,11.95 D23.1 | D19.1_BOTTOM 98.97,11.95 D19.1 | D15.1_BOTTOM 128.18,11.95 D15.1 | D11.1_BOTTOM 157.9,11.95 D11.1 | D7.1_BOTTOM 187.36,11.95 D7.1 | D3.1_BOTTOM 216.82,11.95 D3.1 | v10.87,17.48 11.28,17.08 12.9,17.08 13.11,17.28 13.11,17.89 13.51,18.3 14.33,18.3 15.14,17.48 20.42,17.48 21.64,18.7 22.66,18.7 23.47,17.89 29.16,17.89 30.38,19.11 31.19,19.11 32,18.3 38.1,18.3 v38.51,18.7 38.91,18.3 41.96,18.3 42.77,19.11 44.4,19.11 45.21,18.3 49.68,18.3 50.5,19.11 51.71,19.11 52.53,18.3 55.17,18.3 55.98,19.11 56.79,19.11 57.61,18.3 67.36,18.3 v67.77,18.7 68.17,18.3 71.02,18.3 71.83,19.11 73.66,19.11 74.47,18.3 78.74,18.3 79.55,19.11 80.77,19.11 81.59,18.3 84.43,18.3 85.24,19.11 86.26,19.11 87.07,18.3 96.22,18.3 v96.62,18.7 97.03,18.3 101.09,18.3 101.91,19.11 103.53,19.11 104.34,18.3 108.61,18.3 109.42,19.11 110.64,19.11 111.46,18.3 113.49,18.3 114.3,19.11 115.11,19.11 115.93,18.3 126.09,18.3 v126.49,18.7 126.9,18.3 130.15,18.3 130.96,19.11 132.59,19.11 133.4,18.3 137.87,18.3 138.68,19.11 139.9,19.11 140.72,18.3 143.36,18.3 144.17,19.11 144.98,19.11 145.8,18.3 155.35,18.3 v155.75,18.7 156.16,18.3 160.22,18.3 161.04,19.11 162.66,19.11 163.47,18.3 167.74,18.3 168.55,19.11 169.77,19.11 170.59,18.3 172.62,18.3 173.63,19.31 174.65,19.31 175.67,18.3 184.61,18.3 v185.01,18.7 185.42,18.3 189.48,18.3 190.3,19.11 191.92,19.11 192.74,18.3 197,18.3 197.81,19.11 199.03,19.11 199.85,18.3 204.72,18.3 205.54,19.11 206.35,19.11 207.16,18.3 214.68,18.3 v215.09,18.7
L1_R4
  Top 0.508: RN1.P$5 226.86,30.17 IC2.23
L1_R4_LED  (via drill 0.43)
  Top 0.203: 2.38,11.03 2.34,9.45 v2.13,9.25 | v31.8,8.75 32.17,9.12 D28.1_TOP | v61.47,8.75 61.64,8.91 D24.1_TOP | v91.14,8.75 91.1,8.78 D20.1_TOP | v120.19,8.75 120.31,8.86 D16.1_TOP | v149.86,8.75 150.03,8.91 D12.1_TOP | v179.32,8.75 179.49,8.91 D8.1_TOP | v208.79,9.36 208.96,9.73 D4.1_TOP | D4.1 207.52,11.95 206.76,11.19 206.76,9.15 207.77,8.14 227.89,8.14 228.5,8.75 228.5,12.51 229.51,13.52 229.51,19.72 227.89,21.35 227.89,24.39 228.3,24.8 228.3,26.02 228.7,26.43 228.7,26.65 RN1.P$4
  Top 0.254: D32.1 1.69,11.72 2.38,11.03 D32.1_TOP | D28.1 31.16,11.72 D28.1_TOP | D24.1 60.62,11.72 D24.1_TOP | D20.1 90.09,11.72 D20.1_TOP | D16.1 119.3,11.72 D16.1_TOP | D12.1 149.01,11.72 D12.1_TOP | D8.1 178.48,11.74 D8.1_TOP | D4.1 207.94,11.72 D4.1_TOP
  Bottom 0.203: D32.1_BOTTOM 3.21,11.95 D32.1 | D28.1_BOTTOM 32.67,11.95 D28.1 | D24.1_BOTTOM 62.14,11.95 D24.1 | D20.1_BOTTOM 91.6,11.95 D20.1 | D16.1_BOTTOM 120.81,11.95 D16.1 | D12.1_BOTTOM 150.53,11.95 D12.1 | D8.1_BOTTOM 179.99,11.98 D8.1 | D4.1_BOTTOM 209.46,11.95 D4.1 | v2.13,9.25 2.24,9.15 5.39,9.15 6.4,10.17 7.21,10.17 8.23,9.15 31.39,9.15 v31.8,8.75 32.21,9.15 61.06,9.15 v61.47,8.75 61.87,9.15 90.73,9.15 v91.14,8.75 91.54,9.15 119.79,9.15 v120.19,8.75 120.6,9.15 149.45,9.15 v149.86,8.75 150.27,9.15 178.92,9.15 v179.32,8.75 179.73,9.15 208.18,9.15 208.38,9.36 v208.79,9.36
MISO
  Top 0.406: IC2.26 223.4,35.21 226.11,35.21 229.73,31.59
  Top 0.508: 229.73,31.59 IC3.2
MOSI  (via drill 0.41)
  Top 0.406: IC2.25 223.92,34.6 225.2,34.6 227.08,32.72 v227.08,32.42
  Top 0.508: IC3.5 232.64,36.08 v234.24,36.08
  Bottom 0.406: v227.08,32.42 227.13,32.37 233.83,32.37 234.24,32.78 v234.24,36.08
MUX_D0
  Top 0.254: 201.47,28.46 203.5,30.49 208.99,30.49 210.21,31.71 210.21,32.49 IC2.44
  Top 0.406: IC5.11 203.6,24.1 201.47,26.22 201.47,28.46
MUX_D1
  Top 0.254: 202.29,28.46 203.81,29.98 210.24,29.98 IC2.1
  Top 0.406: 202.29,28.46 202.29,26.43 203.96,24.75 IC5.10
MUX_D2
  Top 0.254: 203.1,28.46 204.11,29.47 209.4,29.47 210.01,28.86 210.26,28.86 IC2.2
  Top 0.406: 203.1,28.46 203.1,26.63 204.33,25.4 IC5.9
MUX_EN  (via drill 0.41)
  Top 0.406: v210.01,24.8 210.06,24.75 IC5.7 213.48,24.75 R5.1
  Top 0.508: v210.21,27.64 210.21,27.69 IC2.3
  Bottom 0.203: v210.21,27.64 210.21,25 v210.01,24.8
N$1
  Top 0.203: IC1.1 202.51,37.58
  Top 0.61: 202.51,37.58 L1.2
  Top 0.813: L1.2 200.94,37.58 201.07,37.7 201.07,37.8 200.97,37.91 202.59,37.91
N$2  (via drill 0.8, 0.9)
  Top 0.203: 204.72,37.96 IC1.3 204.79,37.96
  Top 0.356: 204.72,37.96 204.72,38.82 204.52,39.02 203.1,39.02 202.86,39.26 IC1.6
  Top 0.635: L1.1 201.01,40.58 201.36,40.22 IC1.6
  Top 0.66: C1.+ 204.79,37.96
  Top 0.813: 201.01,40.58 202.66,40.58 202.69,40.55
  Top 1.27: C1.+ 207.37,36.89 v208.48,35.77 | S2.2 216.26,41.63 216,41.41 v215.95,41.34
  Bottom 1.27: v215.95,41.34 215.29,40.65 210.41,35.77 v208.48,35.77
N$4
  Top 1.27: BAT1.PLUS1 BAT1.PLUS2
  Bottom 1.676: BAT1.PLUS1 BAT2.MINUS1 BAT2.MINUS2
N$5
  Top 1.016: 223.83,41.46 229.31,41.46 BAT2.PLUS1
  Top 1.27: BAT2.PLUS2 223.83,41.46 224.33,41.94 224.36,46.14 220.4,50.1 216.18,50.1 213.76,47.67 S2.1
N$6  (via drill 0.41)
  Top 0.203: R1.2 204.76,42.63
  Top 0.635: 204.76,42.63 IC1.4 205.55,39.43 v205.74,39.43
  Top 0.813: v205.74,35.77 205.69,35.82 R2.1
  Bottom 0.762: v205.74,39.43 v205.74,35.77
N$8
  Top 0.203: M1.11 177.7,28.75
  Top 0.66: 177.7,28.75 177.6,28.65 177.6,27.34 176.89,26.63 175.46,26.63 174.65,25.82 R3.1
PDI_CLOCK  (via drill 0.41)
  Top 0.203: v219.25,40.55 217.12,38.41 217.12,37.5
  Top 0.254: 217.12,37.5 216.61,36.99 216.36,36.99 IC2.35
  Bottom 0.254: X1.4 235.18,23.3 230.43,28.05 229.01,28.05 225.15,31.91 225.15,34.45 226.47,35.77 226.47,40.65 224.23,42.88 222.4,42.88 220.47,40.95 219.66,40.95 v219.25,40.55
PDI_DATA  (via drill 0.41)
  Top 0.254: v219.15,41.67 216.21,38.72 216.1,38.52 215.7,38.79 IC2.34
  Bottom 0.254: X1.3 233.48,25.82 230.73,28.56 229.31,28.56 225.65,32.22 225.65,34.15 226.97,35.47 226.97,40.95 224.54,43.39 222.2,43.39 220.47,41.67 v219.15,41.67
ROW1_LED
  Top 0.406: D1.4_TOP 231.05,14.6 D1.4 | D2.4_TOP 223.69,14.6 D2.4 | D3.4_TOP 216.32,14.6 D3.4 | D4.4_TOP 208.96,14.6 D4.4 209.8,15.55 209.8,16.47 213.06,19.72 213.06,21.14 213.05,22.8 IC5.4
  Bottom 0.406: D1.4_BOTTOM 232.8,14.65 D1.4 231.8,15.5 231.34,15.05 225.04,15.05 224.59,15.5 D2.4 | D2.4_BOTTOM 225.44,14.65 D2.4 | D3.4_BOTTOM 218.07,14.65 D3.4 | D4.4_BOTTOM 210.71,14.65 D4.4 211.18,15.5 211.63,15.05 213.26,15.05 213.67,15.45 D3.4 | D2.4 D3.4
  pour Bottom (no thermals): 244.96,18.5 206.35,18.5 206.35,5.9 244.96,5.9
  pour Top (isolate 0.305, no thermals): 244.96,18.5 206.35,18.5 206.35,5.9 244.96,5.9
ROW2_LED  (via drill 0.41)
  Top 0.406: D5.4_TOP 201.59,14.6 D5.4 | D6.4_TOP 194.22,14.6 D6.4 | D7.4_TOP 186.86,14.6 D7.4 | D8.4_TOP 179.49,14.63 D8.4 182.37,17.51 | IC5.3 210.42,22.15 v210.01,22.56
  Top 0.813: v182.37,20.33 182.37,17.51
  Bottom 0.406: D5.4_BOTTOM 203.34,14.65 D5.4 D6.4 | D6.4_BOTTOM 195.97,14.65 D6.4 | D7.4_BOTTOM 188.61,14.65 D7.4 | D8.4_BOTTOM 181.24,14.68 180.54,15.38 | D8.4 180.54,15.38 | 180.54,15.38 187.64,15.38 D7.4 | D7.4 D6.4 | v210.01,22.56 205.94,22.56 204.32,20.94 182.98,20.94 v182.37,20.33
  pour Bottom (no thermals): 177.09,18.5 205.13,18.5 205.13,5.9 177.09,5.9
  pour Top (isolate 0.305, no thermals): 205.13,18.5 205.13,5.9 177.09,5.9 177.09,18.5
ROW3_LED  (via drill 0.41)
  Top 0.406: D9.4_TOP 172.12,14.6 D9.4 172.42,16.11 172.42,18.91 173.43,19.92 v180.04,19.92 | D10.4_TOP 164.76,14.6 D10.4 | D11.4_TOP 157.39,14.6 D11.4 | D12.4_TOP 150.03,14.6 D12.4 | IC5.2 210.16,21.5 208.79,20.13 202.49,20.13 201.37,21.24 192.43,21.24 191.92,20.74 184.81,20.74 183.39,22.16 180.65,22.16 v180.04,21.55
  Bottom 0.406: D9.4_BOTTOM 173.88,14.65 D9.4 D10.4 | D10.4_BOTTOM 166.51,14.65 D10.4 | D11.4_BOTTOM 159.14,14.65 D11.4 | D12.4_BOTTOM 151.78,14.65 D12.4 D11.4 | D10.4 D11.4 | v180.04,21.55 v180.04,19.92
  pour Bottom (no thermals): 147.83,17.69 176.28,17.69 176.28,5.9 147.83,5.9
  pour Top (isolate 0.305, no thermals): 176.28,19.72 176.28,5.9 147.83,5.9 147.83,19.72
ROW4_LED
  Top 0.406: D13.4_TOP 142.66,14.6 D13.4 143.15,15.91 143.15,19.11 144.78,20.74 180.49,20.74 181.1,21.35 182.98,21.35 184.4,19.92 192.33,19.92 192.94,20.53 201.07,20.53 202.08,19.52 209.19,19.52 210.53,20.85 IC5.1 | D14.4_TOP 135.3,14.6 D14.4 | D15.4_TOP 127.68,14.6 D15.4 | D16.4_TOP 120.31,14.6 D16.4
  Bottom 0.406: D13.4_BOTTOM 144.41,14.65 D13.4 D14.4 | D14.4_BOTTOM 137.05,14.65 D14.4 | D15.4_BOTTOM 129.43,14.65 D15.4 | D16.4_BOTTOM 122.06,14.65 D16.4 D15.4 | D14.4 D15.4
  pour Top (isolate 0.305, no thermals): 117.75,20.94 146.61,20.94 146.61,5.9 117.75,5.9
  pour Bottom (no thermals): 146.61,27.04 146.61,5.9 117.75,5.9 117.75,27.04
ROW5_LED
  Top 0.406: D17.4_TOP 112.94,14.6 D17.4 113.69,15.66 113.69,19.11 116.13,21.55 178.71,21.55 180.14,22.97 183.79,22.97 184.81,21.95 201.68,21.95 202.13,21.5 IC5.15 | D18.4_TOP 105.83,14.6 D18.4 | D19.4_TOP 98.47,14.6 D19.4 | D20.4_TOP 91.1,14.6 D20.4
  Bottom 0.406: D17.4_BOTTOM 114.69,14.65 D17.4 D18.4 | D18.4_BOTTOM 107.58,14.65 D18.4 | D19.4_BOTTOM 100.22,14.65 D19.4 | D20.4_BOTTOM 92.85,14.65 D20.4 D19.4 | D18.4 D19.4
  pour Bottom (no thermals): 116.94,27.04 116.94,5.9 88.49,5.9 88.49,27.04
  pour Top (isolate 0.305, no thermals): 116.94,27.04 116.94,5.9 88.49,5.9 88.49,27.04
ROW6_LED
  Top 0.406: D21.4_TOP 83.73,14.6 D21.4 | D22.4_TOP 76.37,14.6 D22.4 | D23.4_TOP 69,14.6 D23.4 | D24.4_TOP 61.64,14.6 D24.4 69.39,22.36 178.41,22.36 179.83,23.78 184.2,23.78 185.22,22.77 201.88,22.77 202.5,22.15 IC5.14
  Bottom 0.406: D21.4_BOTTOM 85.48,14.65 D21.4 D22.4 | D22.4_BOTTOM 78.12,14.65 D22.4 | D23.4_BOTTOM 70.75,14.65 D23.4 | D24.4_BOTTOM 63.39,14.65 D24.4 D23.4 | D23.4 D22.4
  pour Bottom (no thermals): 87.68,27.44 87.68,5.9 59.23,5.9 59.23,27.44
  pour Top (isolate 0.305, no thermals): 87.68,27.44 87.68,5.9 59.23,5.9 59.23,27.44
ROW7_LED
  Top 0.406: D25.4_TOP 54.27,14.6 D25.4 55.17,18.7 55.98,19.52 65.13,19.52 68.78,23.17 178,23.17 179.43,24.6 184.4,24.6 186.84,27.03 198.63,27.03 202.87,22.8 IC5.13 | D26.4_TOP 46.9,14.6 D26.4 | D27.4_TOP 39.54,14.6 D27.4 | D28.4_TOP 32.17,14.6 D28.4
  Bottom 0.406: D25.4_BOTTOM 56.02,14.65 D25.4 D26.4 | D26.4_BOTTOM 48.65,14.65 D26.4 | D27.4_BOTTOM 41.29,14.65 D27.4 | D28.4_BOTTOM 33.92,14.65 D28.4 D27.4 | D26.4 D27.4
  pour Bottom (no thermals): 58.01,27.44 58.01,5.9 29.97,5.9 29.97,27.44
  pour Top (isolate 0.305, no thermals): 58.01,27.04 58.01,5.9 29.97,5.9 29.97,27.04
ROW8_LED
  Top 0.406: D29.4_TOP 24.81,14.6 D29.4 29.92,19.72 44.6,19.72 45.42,20.53 64.92,20.53 68.38,23.99 177.7,23.99 179.02,25.31 184,25.31 186.54,27.85 198.83,27.85 203.23,23.45 IC5.12 | D30.4_TOP 17.44,14.6 D30.4 | D31.4_TOP 10.07,14.6 D31.4 | D32.4_TOP 2.71,14.6 D32.4
  Bottom 0.406: D29.4_BOTTOM 26.56,14.65 D29.4 D30.4 | D30.4_BOTTOM 19.19,14.65 D30.4 | D31.4_BOTTOM 11.82,14.65 D31.4 | D32.4_BOTTOM 4.46,14.65 D32.4 4.93,15.5 6.4,14.03 8.03,14.03 9.45,15.45 D31.4 | D30.4 D31.4
  pour Top (isolate 0.305, no thermals): 28.75,28.25 28.75,-0.6 0.71,-0.6 0.71,28.25
  pour Bottom (no thermals): 28.75,28.25 28.75,-0.6 0.71,-0.6 0.71,28.25
RXD  (via drill 0.41)
  Top 0.203: 162.66,28.41 M1.1
  Top 0.508: v211.23,27.03 211.63,26.63 212.55,26.63 IC2.6
  Top 0.914: v162.66,25.31 162.66,28.41
  Bottom 0.203: v211.23,27.03 211.23,24.8 210.21,23.78 198.43,23.78 196.49,21.85 184.1,21.85 179.83,26.12 163.47,26.12 v162.66,25.31
SCK
  Top 0.406: IC2.27 222.92,35.87 227.08,35.87 227.33,36.13 227.33,37.8 227.74,38.21 230.53,38.21
  Top 0.508: IC3.6 231.01,37.73 230.53,38.21
SEC_CS  (via drill 0.41)
  Top 0.406: v218.24,26.32 219.11,26.32 IC2.14
  Top 0.914: M1.16 180.05,34.44 v179.93,34.55
  Bottom 0.203: v179.93,34.55 179.93,34.76 181.15,35.98 181.15,36.79 186.64,42.27 204.32,42.27 206.55,40.04 206.55,34.96 208.18,33.33 212.65,33.33 215.29,35.98 216.1,35.98 216.81,35.26 218.03,35.26 218.75,34.55 218.75,29.07 218.14,28.46 218.14,26.43 v218.24,26.32
SEC_MISO  (via drill 0.41)
  Top 0.406: v219.56,28.05 219.67,27.94 219.76,27.94 IC2.16
  Top 0.914: M1.18 179.97,37.44 v179.93,37.4
  Bottom 0.203: v179.93,37.4 180.14,37.4 186.03,43.29 204.52,43.29 207.37,40.45 207.37,35.37 208.59,34.15 212.24,34.15 215.09,36.99 217.53,36.99 219.56,34.96 v219.56,28.05
SEC_MOSI  (via drill 0.41)
  Top 0.203: v217.12,36.18 217.12,36.79 217.63,37.3 217.63,38.21 219.15,39.73 219.96,39.73 220.57,40.34
  Top 0.356: 220.57,40.34 220.57,41.06 222.71,43.19 222.71,44.92 v223.01,45.22
  Top 0.406: v218.95,27.24 219.35,27.21 IC2.15
  Top 0.914: M1.17 179.97,35.94 v179.93,35.98
  Bottom 0.203: v179.93,35.98 180.75,36.79 180.75,37.19 186.23,42.68 204.52,42.68 206.96,40.24 206.96,35.16 208.38,33.74 212.45,33.74 215.09,36.38 216.92,36.38 v217.12,36.18 217.73,36.18 219.15,34.76 219.15,28.86 218.54,28.25 218.54,27.64 v218.95,27.24
  Bottom 0.508: X2.3 225.1,45.22 v223.01,45.22
SEC_SCK  (via drill 0.41)
  Top 0.406: v220.37,28.66 220.37,28.46 IC2.17
  Top 0.914: M1.19 180.02,38.94 v179.93,39.02
  Bottom 0.203: v179.93,39.02 180.95,39.02 186.64,44.71 212.14,44.71 214.38,42.48 216.21,42.48 217.73,40.95 217.73,37.5 219.96,35.26 219.96,29.07 v220.37,28.66
  Bottom 0.508: X2.4 226.75,44 219.56,44 217.73,42.17 217.73,40.95
TXD  (via drill 0.41)
  Top 0.203: 213.82,26.79 IC2.7 | 164.19,28.54 M1.2
  Top 0.508: 213.82,26.79 214.68,27.64 v214.68,28.46
  Top 0.914: v164.19,25.31 164.19,28.54
  Bottom 0.203: v214.68,28.46 214.68,27.64 210.41,23.38 198.83,23.38 196.9,21.45 183.49,21.45 179.43,25.51 164.29,25.51 v164.19,25.31

## Text on the board
tPlace: ANIBIKE | ON | 2V7 BT | OFF | DAVID M. (C) 2010